# Altium project BSPZ.PrjPcb
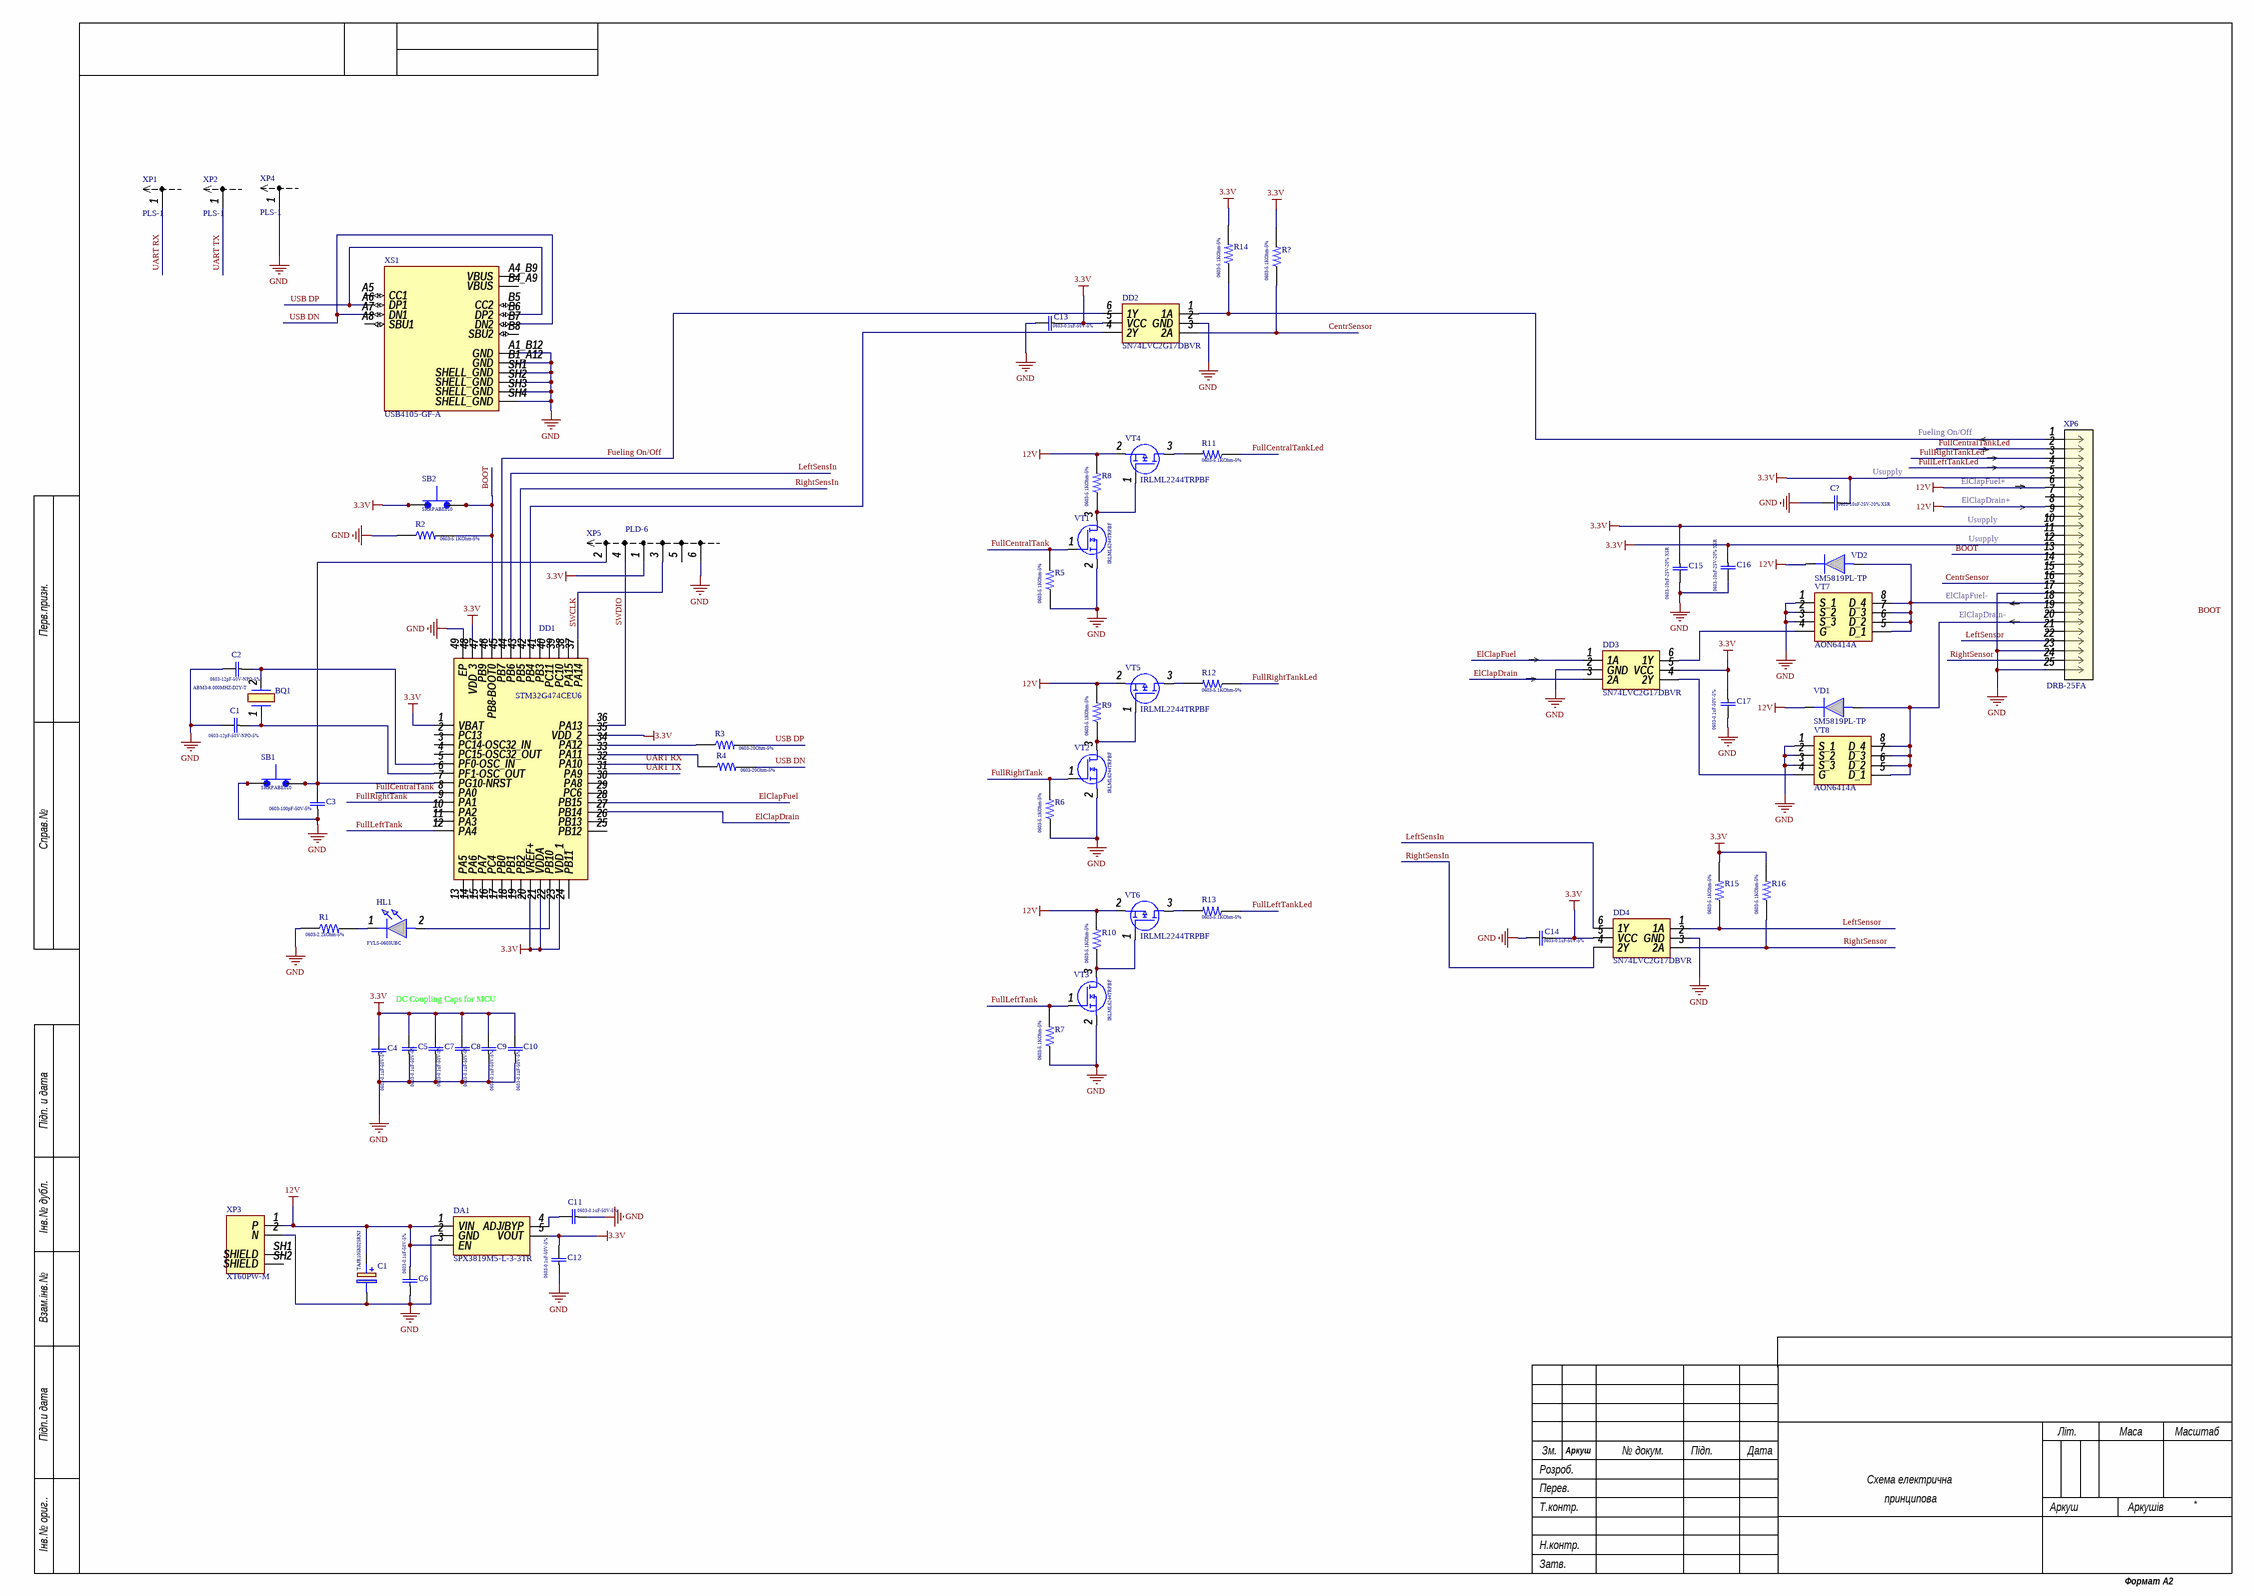
[diagram p0: BSPZ.SchDoc]
1 sheet, 62 parts. Net scope: global (net labels, ports and power ports of the same name join across sheets).
Board file: BSPZ.PcbDoc

## Sheet BSPZ.SchDoc
size 594 x 420 mm

### Parts
BQ1  ABM3-8.000MHZ-D2Y-T  [ABM3-25.000MHz]
C1  0603-12pF-50V-NPO-5%  [C0603]
C2  0603-12pF-50V-NPO-5%  [C0603]
C3  0603-100pF-50V-5%  [C0603]
C4  0603-0.1uF-50V-5%  [C0603]
C5  0603-0.1uF-50V-5%  [C0603]
C6  0603-0.1uF-50V-5%  [C0603]
C7  0603-0.1uF-50V-5%  [C0603]
C8  0603-0.1uF-50V-5%  [C0603]
C9  0603-0.1uF-50V-5%  [C0603]
C10  0603-0.1uF-50V-5%  [C0603]
C11  0603-0.1uF-50V-5%  [C0603]
C12  0603-0.1uF-50V-5%  [C0603]
C13  0603-0.1uF-50V-5%  [C0603]
C14  0603-0.1uF-50V-5%  [C0603]
C15  0603-10uF-25V-20% X5R  [C0603]
C16  0603-10uF-25V-20% X5R  [C0603]
C17  0603-0.1uF-50V-5%  [C0603]
C?  0603-10uF-25V-20% X5R  [C0603]
DA1  SPX3819M5-L-3-3TR  [SOT95P280x145-5N]
DD1  STM32G474CEU6  [QFN50P700X700X60-49N-D]
DD2  SN74LVC2G17DBVR  [SOT95P280x145-6N]
DD3  SN74LVC2G17DBVR  [SOT95P280x145-6N]
DD4  SN74LVC2G17DBVR  [SOT95P280x145-6N]
HL1  FYLS-0603UBC  [LED0603]
R1  0603-2.2kOhm-5%  [Res0603]
R2  0603-5.1KOhm-5%  [Res0603]
R3  0603-20Ohm-5%  [Res0603]
R4  0603-20Ohm-5%  [Res0603]
R5  0603-5.1KOhm-5%  [Res0603]
R6  0603-5.1KOhm-5%  [Res0603]
R7  0603-5.1KOhm-5%  [Res0603]
R8  0603-5.1KOhm-5%  [Res0603]
R9  0603-5.1KOhm-5%  [Res0603]
R10  0603-5.1KOhm-5%  [Res0603]
R11  0603-5.1KOhm-5%  [Res0603]
R12  0603-5.1KOhm-5%  [Res0603]
R13  0603-5.1KOhm-5%  [Res0603]
R14  0603-5.1KOhm-5%  [Res0603]
R15  0603-5.1KOhm-5%  [Res0603]
R16  0603-5.1KOhm-5%  [Res0603]
R?  0603-5.1KOhm-5%  [Res0603]
SB1  SKRPABE010  [SKRPABE010]
SB2  SKRPABE010  [SKRPABE010]
VD1  SM5819PL-TP  [SM5819PL-TP (SOD123)]
VD2  SM5819PL-TP  [SM5819PL-TP (SOD123)]
VT1  IRLML6244TRPBF  [SOT95P230x110-3N]
VT2  IRLML6244TRPBF  [SOT95P230x110-3N]
VT3  IRLML6244TRPBF  [SOT95P230x110-3N]
VT4  IRLML2244TRPBF  [SOT95P237x112-3N]
VT5  IRLML2244TRPBF  [SOT95P237x112-3N]
VT6  IRLML2244TRPBF  [SOT95P237x112-3N]
VT7  AON6414A  [8-DFN (5x6)]
VT8  AON6414A  [8-DFN (5x6)]
XP1  PLS-1  [PLS-1]
XP2  PLS-1  [PLS-1]
XP3  XT60PW-M  [XT60PW-M]
XP4  PLS-1  [PLS-1]
XP5  PLD-6  [PLD-6]
XP6  DRB-25FA  [ID25P33E4GV00LF]
XS1  USB4105-GF-A  [GCT_USB4105-GF-A]
С1  TAJR105K025RNJ  [TAJR105K025RNJ]

### Nets
3.3V: C4.2 C5.2 C7.2 C8.2 C9.2 C10.2 C12.2 C13.1 C14.1 C15.1 C16.1 C17.1 C?.1 DA1.5(VOUT) DD1.1(VBAT) DD1.20(VREF+) DD1.21(VDDA) DD1.23(VDD_1) DD1.35(VDD_2) DD1.48(VDD_3) DD2.5(VCC) DD3.5(VCC) DD4.5(VCC) R14.2 R15.2 R16.2 SB2.1 SB2.2 XP5.1 XP6.5 XP6.10 XP6.12
12V: C6.2 DA1.1(VIN) DA1.3(EN) R8.2 R9.2 R10.2 VD1.1(K) VD2.1(K) VT4.2(S) VT5.2(S) VT6.2(S) XP3.1(P) XP6.6 XP6.8 С1.1(+)
GND: C1.2 C2.2 C3.1 C4.1 C5.1 C6.1 C7.1 C8.1 C9.1 C10.1 C11.1 C12.1 C13.2 C14.2 C15.2 C16.2 C17.2 C?.2 DA1.2(GND) DD1.49(EP) DD2.2(GND) DD3.2(GND) DD4.2(GND) R1.1 R2.1 R5.1 R6.1 R7.1 SB1.1 SB1.2 VT1.2(S) VT2.2(S) VT3.2(S) VT7.1(S_1) VT7.2(S_2) VT7.3(S_3) VT8.1(S_1) VT8.2(S_2) VT8.3(S_3) XP3.2(N) XP4.1 XP5.6 XP6.17 XP6.23 XP6.25 XS1.A1_B12(GND) XS1.B1_A12(GND) XS1.SH1(SHELL_GND) XS1.SH2(SHELL_GND) XS1.SH3(SHELL_GND) XS1.SH4(SHELL_GND) С1.2(-)
BOOT: DD1.46(PB8-BOOT0) R2.2 SB2.3 SB2.4 XP6.13
CentrSensor: DD2.3(2A) R?.1 XP6.16
ElClapDrain: DD1.27(PB14) DD3.3(2A)
ElClapFuel: DD1.28(PB15) DD3.1(1A)
Fueling On/Off: DD1.45(PB7) DD2.6(1Y)
FullCentralTank: DD1.8(PA0) R5.2 VT1.1(G)
FullCentralTankLed: R11.1 XP6.2
FullLeftTank: DD1.12(PA4) R7.2 VT3.1(G)
FullLeftTankLed: R13.1 XP6.4
FullRightTank: DD1.9(PA1) R6.2 VT2.1(G)
FullRightTankLed: R12.1 XP6.3
LeftSensIn: DD1.44(PB6) DD4.6(1Y)
LeftSensor: DD4.1(1A) R15.1 XP6.22
RightSensIn: DD1.43(PB5) DD4.4(2Y)
RightSensor: DD4.3(2A) R16.1 XP6.24
UART RX: DD1.32(PA10) XP1.1
UART TX: DD1.31(PA9) XP2.1
USB DN: R4.2 XS1.A7(DN1) XS1.B7(DN2)
USB DP: R3.2 XS1.A6(DP1) XS1.B6(DP2)
NetBQ1_1: BQ1.1 C1.1 DD1.6(PF1-OSC_OUT)
NetBQ1_2: BQ1.2 C2.1 DD1.5(PF0-OSC_IN)
NetC3_2: C3.2 DD1.7(PG10-NRST) SB1.3 SB1.4 XP5.2
NetC11_2: C11.2 DA1.4(ADJ/BYP)
NetDD1_22: DD1.22(PB10) HL1.2(A)
NetDD1_33: DD1.33(PA11) R4.1
NetDD1_34: DD1.34(PA12) R3.1
NetDD1_36: DD1.36(PA13) XP5.4
NetDD1_37: DD1.37(PA14) XP5.3
NetDD1_42: DD1.42(PB4) DD2.4(2Y)
NetDD2_1: DD2.1(1A) R14.1 XP6.1
NetDD3_4: DD3.4(2Y) VT8.4(G)
NetDD3_6: DD3.6(1Y) VT7.4(G)
NetHL1_1: HL1.1(K) R1.2
NetR8_1: R8.1 VT1.3(D) VT4.1(G)
NetR9_1: R9.1 VT2.3(D) VT5.1(G)
NetR10_1: R10.1 VT3.3(D) VT6.1(G)
NetR11_2: R11.2 VT4.3(D)
NetR12_2: R12.2 VT5.3(D)
NetR13_2: R13.2 VT6.3(D)
NetVD1_2: VD1.2(A) VT8.5(D_1) VT8.6(D_2) VT8.7(D_3) VT8.8(D_4) XP6.20
NetVD2_2: VD2.2(A) VT7.5(D_1) VT7.6(D_2) VT7.7(D_3) VT7.8(D_4) XP6.18

Not connected (* = marked no-connect by the designer): DD1 2(PC13) 3(PC14-OSC32_IN) 4(PC15-OSC32_OUT) 10(PA2) 11(PA3) 13(PA5) 14(PA6) 15(PA7) 16(PC4) 17(PB0) 18(PB1) 19(PB2) 24(PB11) 25(PB12) 26(PB13) 29(PC6) 30(PA8) 38(PA15) 39(PC10) 40(PC11) 41(PB3) 47(PB9); R? 2; XP3 SH1(SHIELD) SH2(SHIELD); XP5 5; XP6 7 9 11 14 15 19 21; XS1 A4_B9(VBUS) A5(CC1) A8(SBU1) B4_A9(VBUS) B5(CC2) B8(SBU2)

### Notes on the sheet
- Fueling On/Off
- Usupply
- ElClapFuel+
- ElClapDrain+
- ElClapFuel-
- (near DD1) SWCLK
- SWDIO
- ElClapDrain-
- DC Coupling Caps for MCU
- Labels drawn without touching a wire or pin: 3.3V, BOOT
- Перв.призн.
- Справ.№
- Підп. и дата
- Інв.№ дубл.
- Взам.інв.№
- Підп.и дата
- Розроб.
- Зм.
- Аркуш
- № докум.
- Підп.
- Дата
- Літ.
- Маса
- Масштаб
- Т.контр.
- Перев.
- Схема електрична
- принципова
- Аркушів
- Інв.№ ориг..
- Затв.
- Н.контр.
- Формат А2

### Library data of the parts
BQ1 = ABM3-25.000MHz: ABM3-8.000MHZ-D2Y-T Кварцевий резонатор Космодром код товару: 00-00066552 Виробник:ABRACON
C1 C2 = CAP0603: Чіп кераміка (0603) 12pf (NP0) 50v ± 5% / SMD-конденсатор / Конденсатор керамический, SMD 0603, номинальная емкость: 12pF, номинальное напряжение: 50V, точность +/-5% CL10C120JB8NNNC / Тип корпуса: CAP0603 / Производитель: SAMSUNG / Космодром код товара: 00-00034389
C3 = CAP0603: Чіп кераміка (0603) 100pf (NP0) 50v ± 5% / SMD-конденсатор / Конденсатор керамический, SMD 0603, номинальная емкость: 100pF, номинальное напряжение: 50V, точность +/-5% CL10C101JB8NNNC / Тип корпуса: CAP0603 / Производитель: SAMSUNG / Космодром код товара: 00-00034408
C4 C5 C7-C10 C13 C14 C17 = CAP0603: / Чіп кераміка (0603) 0,1mkf (X7R) 50v ±10% / SMD-конденсатор 0603 / Конденсатор керамический, SMD 0603, номинальная емкость: 100nF, номинальное напряжение: 50V, точность +/-10% CL10B104KB8NNNC / Тип корпуса: CAP0603 / Производитель: SAMSUNG / Космодром код товара: 00-00052755
C6 C11 = CAP0603: / Чіп кераміка (0603) 0,1mkf (X7R) 50v ±10% / SMD-конденсатор 0603 / Конденсатор керамический, SMD 0603, номинальная емкость: 100nF, номинальное напряжение: 50V, точность +/-10% CL10B104KB8NNNC / Тип корпуса: CAP0603 / Производитель: SAMSUNG / код товара: 00-00052755
C12 = CAP0603: / Чіп кераміка (0603) 0,1mkf (X7R) 50v ±10% / SMD-конденсатор 0603 / Конденсатор керамический, SMD 0603, номинальная емкость: 100nF, номинальное напряжение: 50V, точность +/-10% CL10B104KB8NNNC / Тип корпуса: CAP0603 / Производитель: SAMSUNG / Космодром  код товара: 00-00052755
C15 C16 C? = CAP0603: Чіп кераміка (0603) 10mkf (X5R) 25v 20% / SMD-конденсатор / CL10A106MA8NRNC 10 uF, 25 VDC, X5R, 20 % / Тип корпуса: CAP0603 / Производитель: SAMSUNG / Космодром код товара: 00-00076287
DA1 = SPX3819M5-L-3-3TR: SPX3819M5-L-3-3/TR / Стабилизатор напряжения / LDO регуляторы напряжения 500mA / Тип корпуса: SOT23-5 / Производитель: MaxLinear / Космодром код товара: 00-00071004
DD1 = STM32G474CEU6: STM32G474CEU6 / Виробник: / STMicroelectronics / IC MCU 32BIT 512KB FLSH 48UFQFPN VD MAIS
DD2-DD4 = SN74LVC2G17DBVR: SN74LVC2G17DBVR / Микросхема серии 74LVC / Буфер, триггер Шмитта, 1.65В до 5.5В, SOT-23-6 / Тип корпуса: SOT23-6 / Производитель: TI / Космодром код товара: 00-00023488
HL1 = LED0603: FYLS-0603UBC / Светодиод SMD / Светодиод 0603. Синий ,120mcd 130°, 468nm. 3,3 В. 20 мА. / Производитель: FORYARD / Космодром код товара: 00-00055962
R1 = Res0603: SMD-резистор (0603) 2,2 kom ±5% / SMD-резистор 0603 / SMD-резистор 0603, Номинальная мощность: 0,1 Вт, Номинальное сопротивление: 2,2 кОм, Допустимое отклонение +/- 5% RC0603JR-072K2L / Тип корпуса: RC0603 / Производитель: YAGEO / Космодром код товара: 00-00033888
R2 R5-R16 R? = Res0603: SMD-резистор (0603) 5,1 kom ±5% / SMD-резистор 0603 / SMD-резистор 0603, Номинальная мощность: 0,1 Вт, Номинальное сопротивление: 5,1 кОм, Допустимое отклонение +/- 5% RC0603JR-075K1L / Тип корпуса: RC0603 / Производитель: YAGEO / код товара: 00-00033897
R3 R4 = Res0603: SMD-резистор (0603) 20 om ±5% / SMD-резистор 0603 / SMD-резистор 0603, Номинальная мощность: 0,1 Вт, Номинальное сопротивление: 20 Ом, Допустимое отклонение +/- 5% / Тип корпуса: RC0603 / Производитель: Faithful Link / код товара: 00-00033844 / Тип корпуса: RC0603 / Производитель: YAGEO / код товара: 00-00033897 / Тип корпуса: RC0603 / Производитель: YAGEO / Космодром код товара: 00-00033885
SB1 SB2 = SKRPABE010: SKRPABE010 / Кнопка тактовая / Микропереключатель TACT, SPST, Пол: 2, 0,05A/16ВDC, SMT, 1,6Н, SKRP / Производитель: ALPS / Космодром код товара: 00-00078837
VD1 VD2 = SM5819PL-TP: SM5819PL / Imrad Артикул: 195754 / Производитель: MCC / Корпус: SOD-123
VT1-VT3 = IRLML6244: IRLML6244TRPBF / Транзистор полевой MOSFET / 20V Single N-Channel HEXFET Power MOSFET in a Micro 3 package / Тип корпуса: SOT23-3 / Производитель: INFIN / Космодром код товара: 00-00032383
VT4-VT6 = IRLML2244: IRLML2244TRPBF / Транзистор полевой MOSFET / MOSFET P-CH 20V 4.3A SOT23 / Тип корпуса: SOT23-3 / Производитель: INFIN / Космодром код товара: 00-00032376
VT7 VT8 = AON6414A: AON6414A / Транзистор полевой MOSFET / MOSFET, 31 W, 0.008 Ohm / Тип корпуса: DFN-8(5x6) / Производитель: AOS / Космодром код товара: 00-00072394
XP1 XP2 XP4 = PLS-1: PLS-40-WHITE / Разъем штыревого соединения / Планка штыревая на плату прямая шаг 2,54мм 1x40 контакт. Цвет: белый / Космодром код товара: 00-00056111
XP3 = XT60PW-M: XT60PW-M / Разъем питания / Разъем питания XT60 угловой (папа).Ток до 60А. Цвет: желтый / Производитель: AMASS / Космодром код товара: 00-00061016
XP5 = PLD-6: ZL202-20G / Разъем штыревого соединения / Планка штыревая на плату прямая шаг 2,54мм 2x10, материал контактов - позолота. Обозначение производителя: DS1021-2*10SF11 / Производитель: CONNFLY / Космодром код товара: 00-00040633
XP6 = ID25P33E4GV00LF: DRB-25FA / Imrad Артикул: 201625 / Назва виробника: DS1037-25FNAKT74-0CC / Виробник: CONNFLY
XS1 = USB4105-GF-A: USB4105-GF-A / USB разъем / Разъем USB, USB Типа C, USB 2.0, Гнездо, 16 вывод(-ов) / Производитель: GCT / Космодром код товара: 00-00067987
С1 = TAJR105K025RNJ: TAJR105K025RNJ / Танталовый конденсатор SMD / Конденсатор: танталовый: SMD: 1мкФ: 25В: Корп: R,0805: ±10% / Производитель: AVX / Космодром код товара: 00-00052187